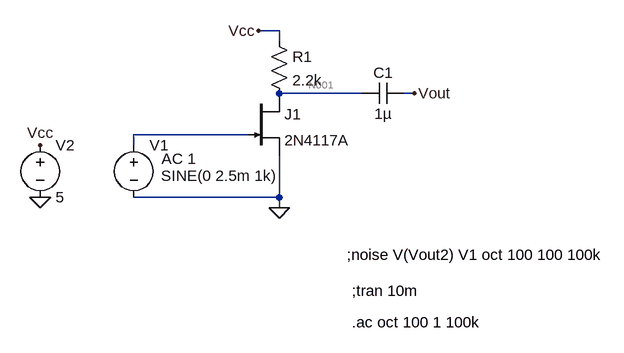
[diagram p0: schematic Building_Preamp_1_OnlyJFET.asc]
Building_Preamp_1_OnlyJFET.asc, the LTspice schematic file:
Version 4
SHEET 1 1540 680
WIRE 208 -32 176 -32
WIRE 208 -16 208 -32
WIRE 336 64 208 64
WIRE 416 64 400 64
WIRE 160 128 -16 128
WIRE -16 144 -16 128
WIRE 208 224 208 160
WIRE 208 224 -16 224
WIRE 208 240 208 224
FLAG -160 224 0
FLAG 208 240 0
FLAG -160 144 Vcc
FLAG 176 -32 Vcc
FLAG 416 64 Vout
SYMBOL voltage -16 128 R0
WINDOW 123 43 37 Left 2
WINDOW 39 0 0 Left 0
WINDOW 3 42 63 Left 2
SYMATTR Value2 AC 1
SYMATTR Value SINE(0 2.5m 1k)
SYMATTR InstName V1
SYMBOL voltage -160 128 R0
WINDOW 123 0 0 Left 0
WINDOW 39 0 0 Left 0
SYMATTR InstName V2
SYMATTR Value 5
SYMBOL res 192 -32 R0
SYMATTR InstName R1
SYMATTR Value 2.2k
SYMBOL cap 400 48 R90
WINDOW 0 0 32 VBottom 2
WINDOW 3 32 32 VTop 2
SYMATTR InstName C1
SYMATTR Value 1µ
SYMBOL njf 160 64 R0
SYMATTR InstName J1
SYMATTR Value 2N4117A
TEXT 320 368 Left 2 !;tran 10m
TEXT 312 312 Left 2 !;noise V(Vout2) V1 oct 100 100 100k
TEXT 320 416 Left 2 !.ac oct 100 1 100k

The netlist it stands for:
* Building_Preamp_1_OnlyJFET.asc
V1 N002 0 SINE(0 2.5m 1k) AC 1
V2 Vcc 0 5
R1 Vcc N001 2.2k
C1 Vout N001 1µ
J1 N001 N002 0 2N4117A
.model NJF NJF
.model PJF PJF
.lib standard.jft
;tran 10m
;noise V(Vout2) V1 oct 100 100 100k
.ac oct 100 1 100k
.backanno
.end

* Results of the author's LTspice run, read from the files saved beside the schematic
* Operating Point, zero values left out:
*   V(vcc) = 5 V
*   V(n001) = 3.159 V
*   V(vout) = 3.159 µV
*   Id(J1) = 836.8 µA
*   Ig(J1) = -3.246 pA
*   Is(J1) = -836.8 µA
*   I(R1) = 836.8 µA
*   I(V2) = -836.8 µA
*   I(V1) = 3.246 pA